# Altium schematic sheet schematic.SchDoc
size A4; SheetNumber: 1; SheetTotal: 1
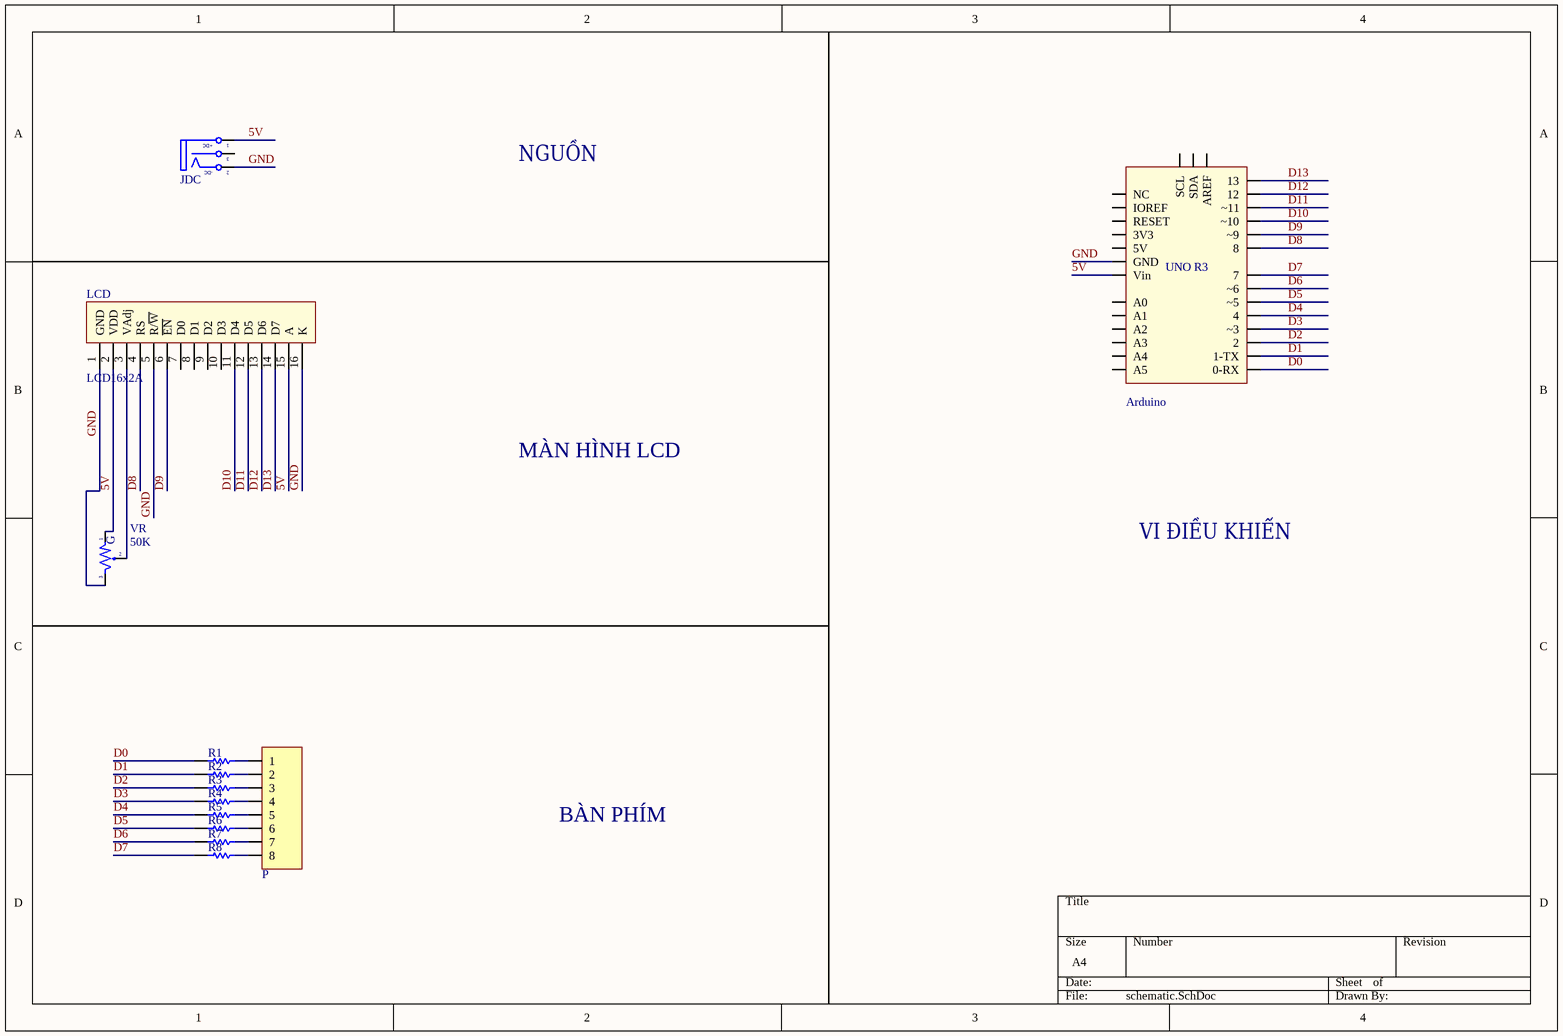
[diagram p0: schematic.SchDoc]

## Parts
Arduino  Arduino Uno R3  [Arduino UNO R3]  (value not drawn)
JDC  Jack DC  [DC-IN]  (value not drawn)
LCD  LCD16x2A  [LCD16X2]
P  Header 8  [JP8]  (value not drawn)
R1  R 0.5W  [R 0.5W]  (value not drawn)
R2  R 0.5W  [R 0.5W]  (value not drawn)
R3  R 0.5W  [R 0.5W]  (value not drawn)
R4  R 0.5W  [R 0.5W]  (value not drawn)
R5  R 0.5W  [R 0.5W]  (value not drawn)
R6  R 0.5W  [R 0.5W]  (value not drawn)
R7  R 0.5W  [R 0.5W]  (value not drawn)
R8  R 0.5W  [R 0.5W]  (value not drawn)
VR  50K  [VR-S1]

## Nets
5V: Arduino.Vin JDC.1(T) LCD.2(VDD) LCD.15(A) VR.1
D0: Arduino.0-RX R1.1
D1: Arduino.1-TX R2.1
D2: Arduino.2 R3.1
D3: Arduino.~3 R4.1
D4: Arduino.4 R5.1
D5: Arduino.~5 R6.1
D6: Arduino.~6 R7.1
D7: Arduino.7 R8.1
D8: Arduino.8 LCD.4(RS)
D9: Arduino.~9 LCD.6(~{EN})
D10: Arduino.~10 LCD.11(D4)
D11: Arduino.~11 LCD.12(D5)
D12: Arduino.12 LCD.13(D6)
D13: Arduino.13 LCD.14(D7)
GND: Arduino.GND JDC.2(TN) LCD.1(GND) LCD.5(R/~{W}) LCD.16(K) VR.3
NetLCD_3: LCD.3(VAdj) VR.2
NetP_1: P.1 R1.2
NetP_2: P.2 R2.2
NetP_3: P.3 R3.2
NetP_4: P.4 R4.2
NetP_5: P.5 R5.2
NetP_6: P.6 R6.2
NetP_7: P.7 R7.2
NetP_8: P.8 R8.2

Not connected (* = marked no-connect by the designer): Arduino 3V3 5V A0 A1 A2 A3 A4 A5 AREF IOREF NC RESET SCL SDA; JDC 3(S); LCD 7(D0) 8(D1) 9(D2) 10(D3)

## Notes on the sheet
- NGUỒN
- MÀN HÌNH LCD
- VI ĐIỀU KHIỂN
- BÀN PHÍM
- (in symbol Arduino Uno R3) UNO R3
- (in symbol Jack DC) +DC; -DC
- (in symbol VR-S) G

## Library data of the parts
Arduino = Arduino Uno R3: Value: Cau 1A
JDC = Jack DC: Jack DC input; Value: Jac DC
LCD = LCD16x2: LCD dipslay 16 char, 2 line; Value: LCD16x2A
P = Header 8: Header, 8-Pin; LatestRevisionDate: 17-Jul-2002; LatestRevisionNote: Re-released for DXP Platform.; Publisher: Altium Limited
VR = VR-S: Var Resistor; Value: Volume 50k